# EAGLE schematic Beta Ref Design (EAGLE 7.7.0)
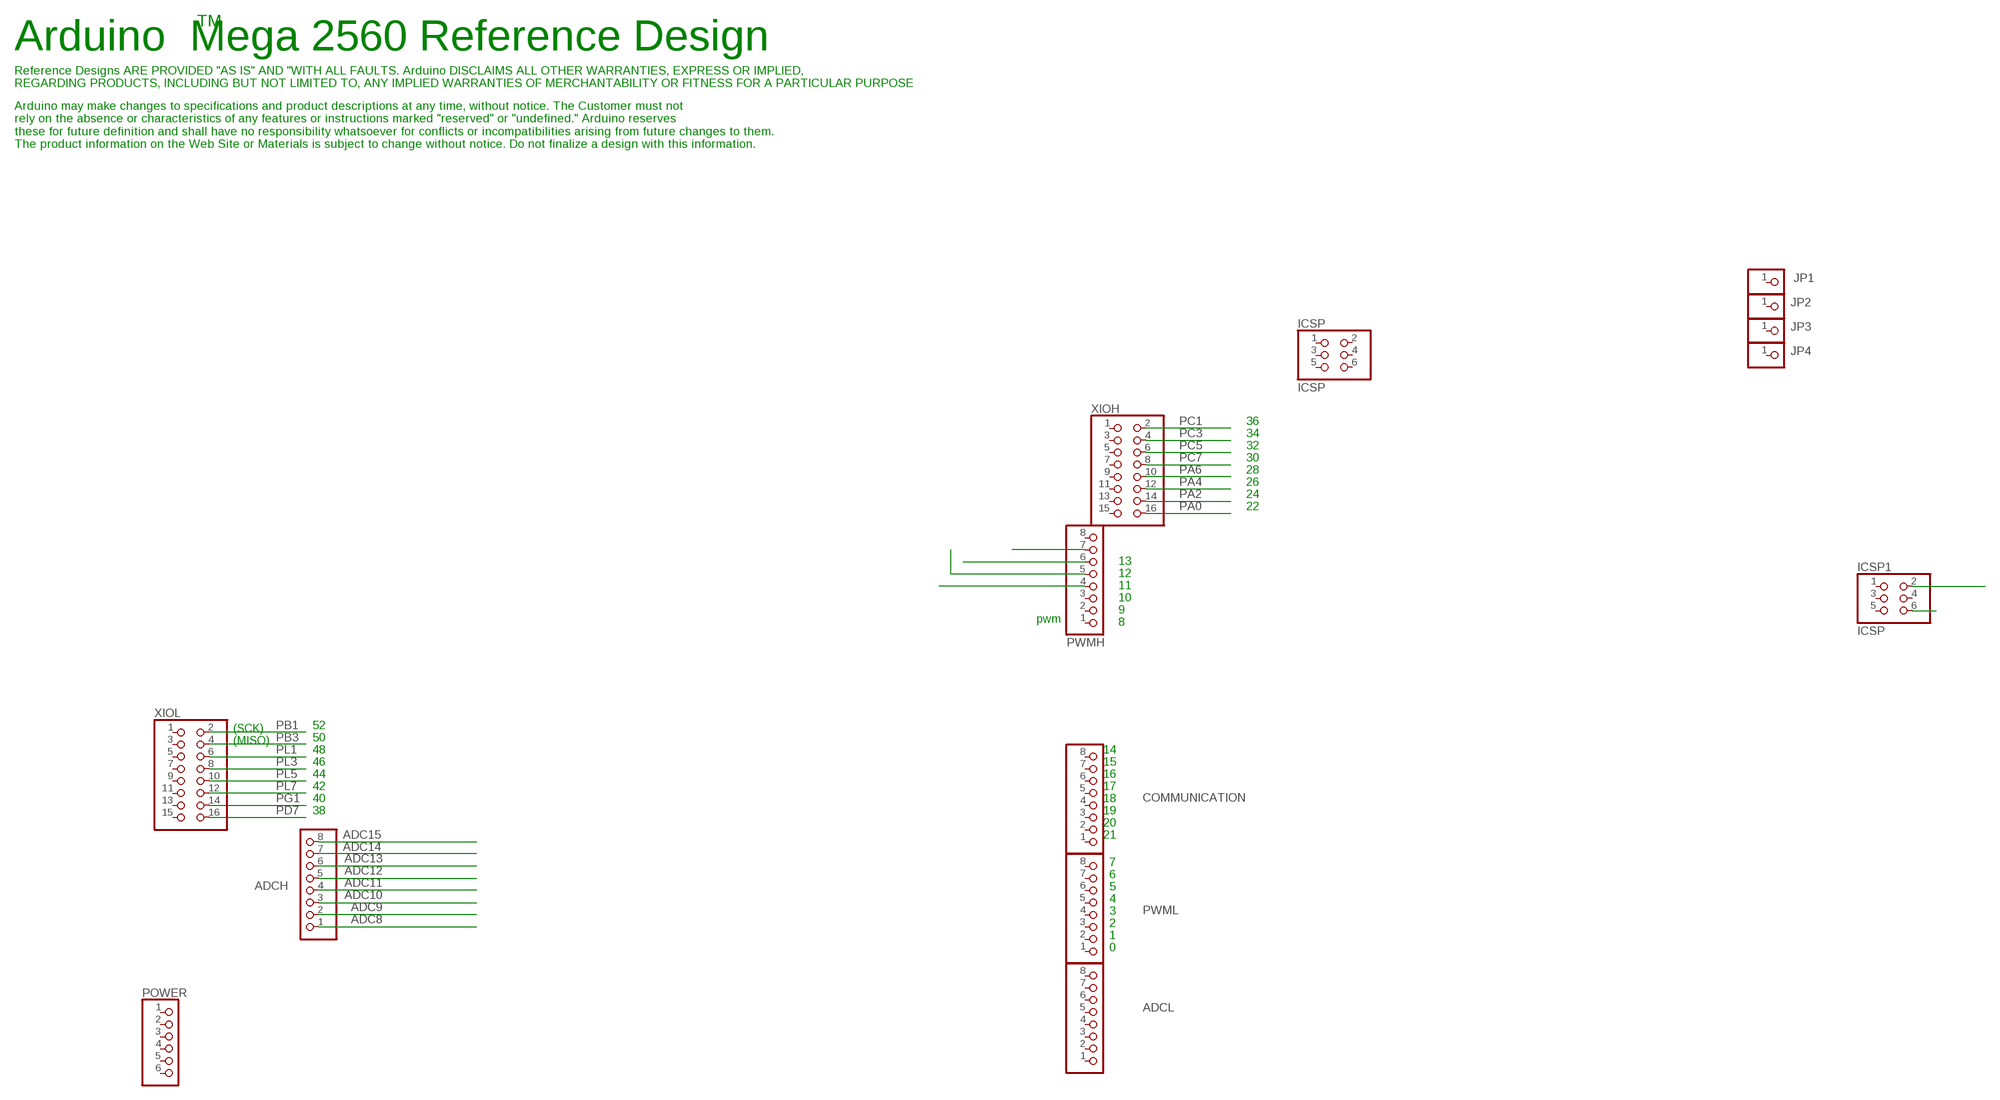
[diagram p0: schematic, sheet 1]

## Parts
ADCH  PINHD-1X8  [1X08]
ADCL  PINHD-1X8  [1X08]
COMMUNICATION  PINHD-1X8  [1X08]
ICSP  ICSP  PINHD-2X3  [2X03]
ICSP1  ICSP  PINHD-2X3  [2X03]
JP1  PINHD-1X1  [1X01]
JP2  PINHD-1X1  [1X01]
JP3  PINHD-1X1  [1X01]
JP4  PINHD-1X1  [1X01]
POWER  PINHD-1X6  [1X06]
PWMH  PINHD-1X8  [1X08]
PWML  PINHD-1X8  [1X08]
XIOH  PINHD-2X8  [2X08]
XIOL  PINHD-2X8  [2X08]

## Nets
ADC8: ADCH.1
ADC9: ADCH.2
ADC10: ADCH.3
ADC11: ADCH.4
ADC12: ADCH.5
ADC13: ADCH.6
ADC14: ADCH.7
ADC15: ADCH.8
GND: PWMH.7
N$1: PWMH.6
N$6: ICSP1.2
N$9: ICSP1.6
PA0: XIOH.16
PA2: XIOH.14
PA4: XIOH.12
PA6: XIOH.10
PB1: XIOL.2
PB3: XIOL.4
PB5: PWMH.4
PB6: PWMH.5
PC1: XIOH.2
PC3: XIOH.4
PC5: XIOH.6
PC7: XIOH.8
PD7: XIOL.16
PG1: XIOL.14
PL1: XIOL.6
PL3: XIOL.8
PL5: XIOL.10
PL7: XIOL.12
Unconnected: ADCL.1 ADCL.2 ADCL.3 ADCL.4 ADCL.5 ADCL.6 ADCL.7 ADCL.8 COMMUNICATION.1 COMMUNICATION.2 COMMUNICATION.3 COMMUNICATION.4 COMMUNICATION.5 COMMUNICATION.6 COMMUNICATION.7 COMMUNICATION.8 ICSP1.1 ICSP1.3 ICSP1.4 ICSP1.5 ICSP.1 ICSP.2 ICSP.3 ICSP.4 ICSP.5 ICSP.6 JP1.1 JP2.1 JP3.1 JP4.1 POWER.1 POWER.2 POWER.3 POWER.4 POWER.5 POWER.6 PWMH.1 PWMH.2 PWMH.3 PWMH.8 PWML.1 PWML.2 PWML.3 PWML.4 PWML.5 PWML.6 PWML.7 PWML.8 XIOH.1 XIOH.3 XIOH.5 XIOH.7 XIOH.9 XIOH.11 XIOH.13 XIOH.15 XIOL.1 XIOL.3 XIOL.5 XIOL.7 XIOL.9 XIOL.11 XIOL.13 XIOL.15

## Notes on the sheet
- TM
- Arduino  Mega 2560 Reference Design
- Reference Designs ARE PROVIDED "AS IS" AND "WITH ALL FAULTS. Arduino DISCLAIMS ALL OTHER WARRANTIES, EXPRESS OR IMPLIED,
  REGARDING PRODUCTS, INCLUDING BUT NOT LIMITED TO, ANY IMPLIED WARRANTIES OF MERCHANTABILITY OR FITNESS FOR A PARTICULAR PURPOSE
- Arduino may make changes to specifications and product descriptions at any time, without notice. The Customer must not
  rely on the absence or characteristics of any features or instructions marked "reserved" or "undefined." Arduino reserves
  these for future definition and shall have no responsibility whatsoever for conflicts or incompatibilities arising from future changes to them.
  The product information on the Web Site or Materials is subject to change without notice. Do not finalize a design with this information.
- 36
- 34
- 32
- 30
- 28
- 26
- 24
- 22
- 13
- 12
- 11
- 10
- 9
- pwm | 8
- (SCK) | 52
- (MISO) | 50
- 48 | 14
- 46 | 15
- 44 | 16
- 42 | 17
- 40 | 18
- 38 | 19
- 20
- 21
- 7
- 6
- 5
- 4
- 3
- 2
- 1
- 0

## Library data of the parts
ADCH ADCL COMMUNICATION PWMH PWML = pinhead:PINHD-1X8: PIN HEADER
ICSP ICSP1 = pinhead:PINHD-2X3: PIN HEADER
JP1-JP4 = pinhead:PINHD-1X1: PIN HEADER
POWER = pinhead:PINHD-1X6: PIN HEADER
XIOH XIOL = pinhead:PINHD-2X8: PIN HEADER

## Net classes
0 default: width 0.15 mm, drill 0.3 mm, clearance 0.15 mm